# EAGLE design voltagereference (EAGLE 9.2.2)
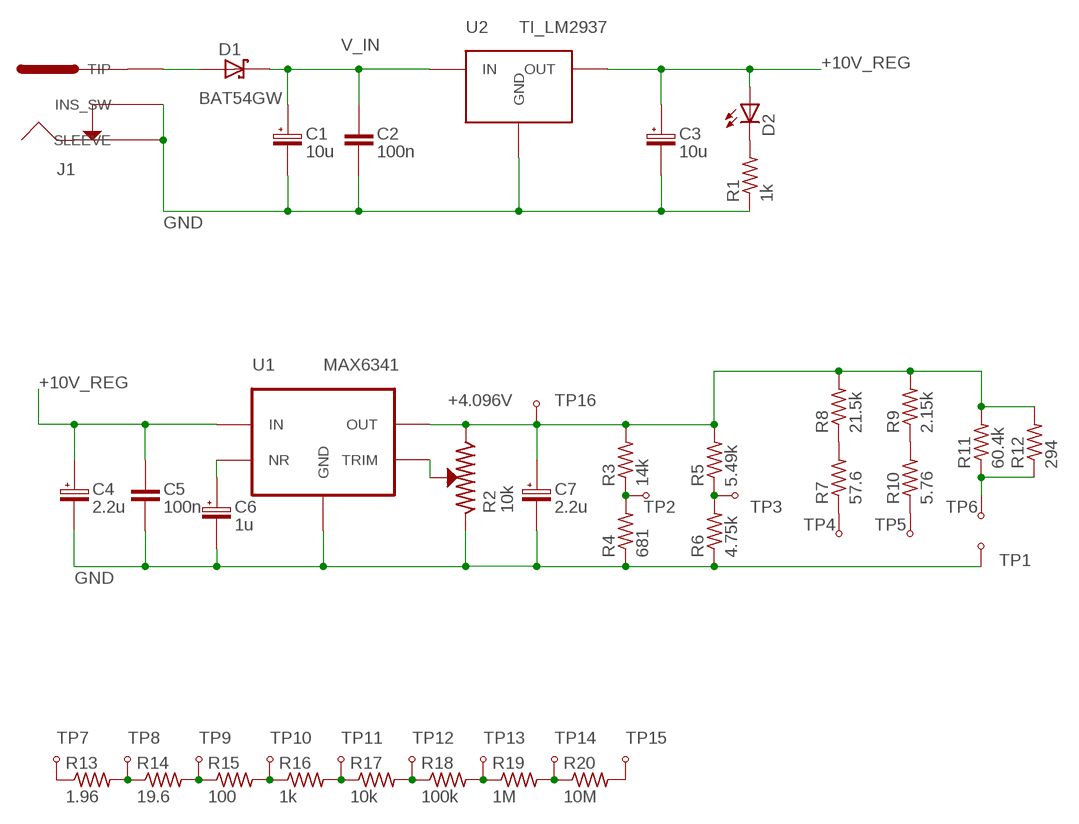
[diagram p0: schematic, sheet 1]

## Parts
C1  10u  PANASONIC_EEE_4MM  [PANASONIC_EEE_4MM]
C2  100n  C_0805  [0805]
C3  10u  PANASONIC_EEE_4MM  [PANASONIC_EEE_4MM]
C4  2.2u  PANASONIC_EEE_4MM  [PANASONIC_EEE_4MM]
C5  100n  C_0805  [0805]
C6  1u  PANASONIC_EEE_4MM  [PANASONIC_EEE_4MM]
C7  2.2u  PANASONIC_EEE_4MM  [PANASONIC_EEE_4MM]
D1  BAT54GW  NEX_BAT54GW  [SOD123_NEX]
D2  LED_0805  [0805_POL]
J1  KOBICONN_163-179PH-EX  [KOBICONN_163-179PH-EX]
R1  1k  R_0805  [0805]
R2  10k  BOURNS_3224X  [BOURNS_3224X]
R3  14k  R_0805  [0805]
R4  681  R_0805  [0805]
R5  5.49k  R_0805  [0805]
R6  4.75k  R_0805  [0805]
R7  57.6  R_0805  [0805]
R8  21.5k  R_0805  [0805]
R9  2.15k  R_0805  [0805]
R10  5.76  R_0805  [0805]
R11  60.4k  R_0805  [0805]
R12  294  R_0805  [0805]
R13  1.96  R_0603  [0603]
R14  19.6  R_0603  [0603]
R15  100  R_0805  [0805]
R16  1k  R_0805  [0805]
R17  10k  R_0805  [0805]
R18  100k  R_0805  [0805]
R19  1M  R_0805  [0805]
R20  10M  R_0805  [0805]
TP1  KEYSTONE_500X  [KEYSTONE_500X]
TP2  KEYSTONE_500X  [KEYSTONE_500X]
TP3  KEYSTONE_500X  [KEYSTONE_500X]
TP4  KEYSTONE_500X  [KEYSTONE_500X]
TP5  KEYSTONE_500X  [KEYSTONE_500X]
TP6  KEYSTONE_500X  [KEYSTONE_500X]
TP7  KEYSTONE_500X  [KEYSTONE_500X]
TP8  KEYSTONE_500X  [KEYSTONE_500X]
TP9  KEYSTONE_500X  [KEYSTONE_500X]
TP10  KEYSTONE_500X  [KEYSTONE_500X]
TP11  KEYSTONE_500X  [KEYSTONE_500X]
TP12  KEYSTONE_500X  [KEYSTONE_500X]
TP13  KEYSTONE_500X  [KEYSTONE_500X]
TP14  KEYSTONE_500X  [KEYSTONE_500X]
TP15  KEYSTONE_500X  [KEYSTONE_500X]
TP16  KEYSTONE_500X  [KEYSTONE_500X]
U1  MAX6341  MAXIM_MAX6341  [SO8_MAX]
U2  TI_LM2937  [SOT223_TI]

## Nets
0.19MA: R7.P$1 TP4.P$1(TP)
1.9MA: R10.P$1 TP5.P$1(TP)
14MA: R11.P$1 R12.P$1 TP6.P$1(TP)
+0.19V: R3.P$1 R4.P$2 TP2.P$1(TP)
+1.9V: R5.P$1 R6.P$2 TP3.P$1(TP)
+4.096V: C7.P$1 R2.P$1 R3.P$2 R5.P$2 R8.P$2 R9.P$2 R11.P$2 R12.P$2 TP16.P$1(TP) U1.P$6(OUT)
+10V_REG: C3.P$1 C4.P$1 C5.P$1 D2.P$1(A) U1.P$2(IN) U2.P$3(OUT)
GND: C1.P$2 C2.P$2 C3.P$2 C4.P$2 C5.P$2 C6.P$2 C7.P$2 J1.P$2(SLEEVE) J1.P$3(INS_SW) J1.P$5(SLEEVE) J1.P$6(INS_SW) R1.P$1 R2.P$3 R4.P$1 R6.P$1 TP1.P$1(TP) U1.P$4(GND) U2.P$2(GND) U2.P$4(GND)
N$1: D2.P$2(C) R1.P$2
N$6: R7.P$2 R8.P$1
N$7: R9.P$1 R10.P$2
N$11: R13.P$2 R14.P$1 TP8.P$1(TP)
N$12: R14.P$2 R15.P$1 TP9.P$1(TP)
N$13: R15.P$2 R16.P$1 TP10.P$1(TP)
N$14: R16.P$2 R17.P$1 TP11.P$1(TP)
N$15: R17.P$2 R18.P$1 TP12.P$1(TP)
N$16: R18.P$2 R19.P$1 TP13.P$1(TP)
N$17: R19.P$2 R20.P$1 TP14.P$1(TP)
N$18: R13.P$1 TP7.P$1(TP)
N$19: R20.P$2 TP15.P$1(TP)
NR: C6.P$1 U1.P$3(NR)
TIP: D1.P$1(A) J1.P$1(TIP) J1.P$4(TIP)
TRIM: R2.P$2 U1.P$5(TRIM)
V_IN: C1.P$1 C2.P$1 D1.P$2(C) U2.P$1(IN)

## Library data of the parts
C1 C3 C4 C6 C7 = travis:PANASONIC_EEE_4MM
C2 C5 = travis:C_0805
D1 = travis:NEX_BAT54GW
D2 = travis:LED_0805
J1 = travis:KOBICONN_163-179PH-EX
R1 R3-R12 R15-R20 = travis:R_0805
R2 = travis:BOURNS_3224X
R13 R14 = travis:R_0603
TP1-TP16 = travis:KEYSTONE_500X
U1 = travis:MAXIM_MAX6341
U2 = travis:TI_LM2937

## Board
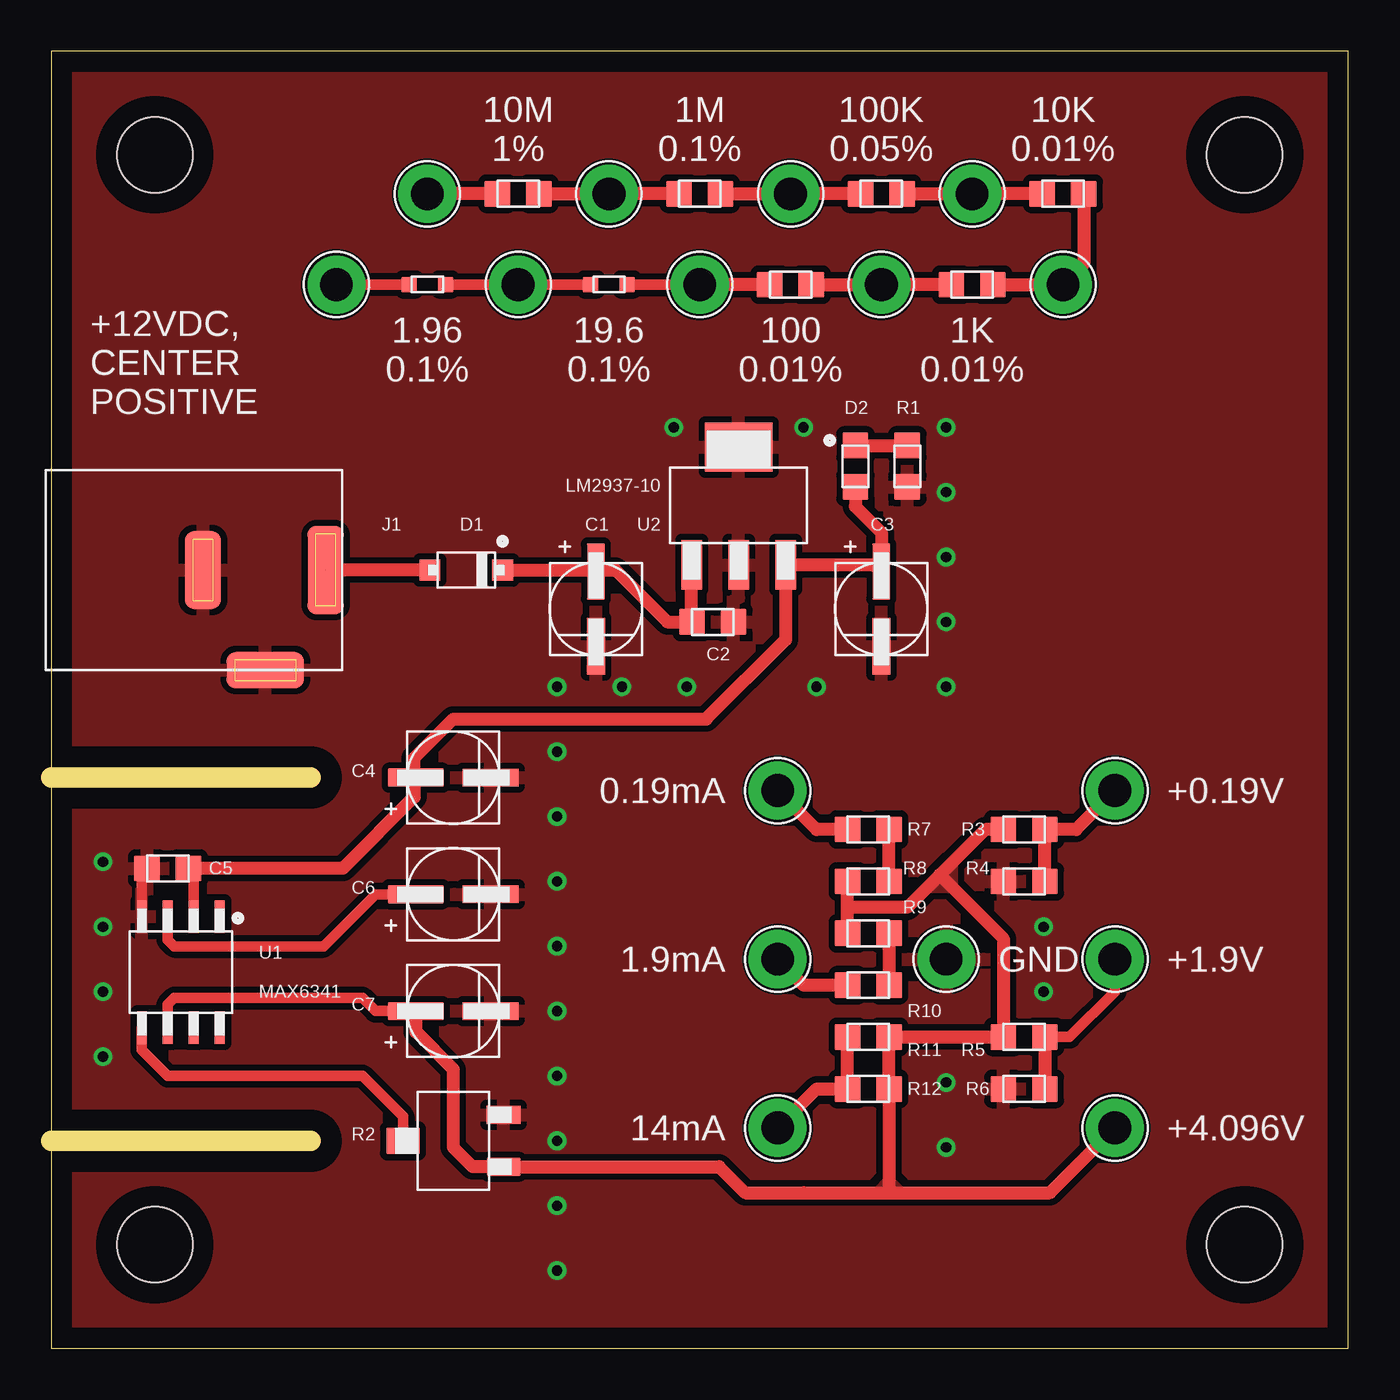
[diagram p1: board, top side]
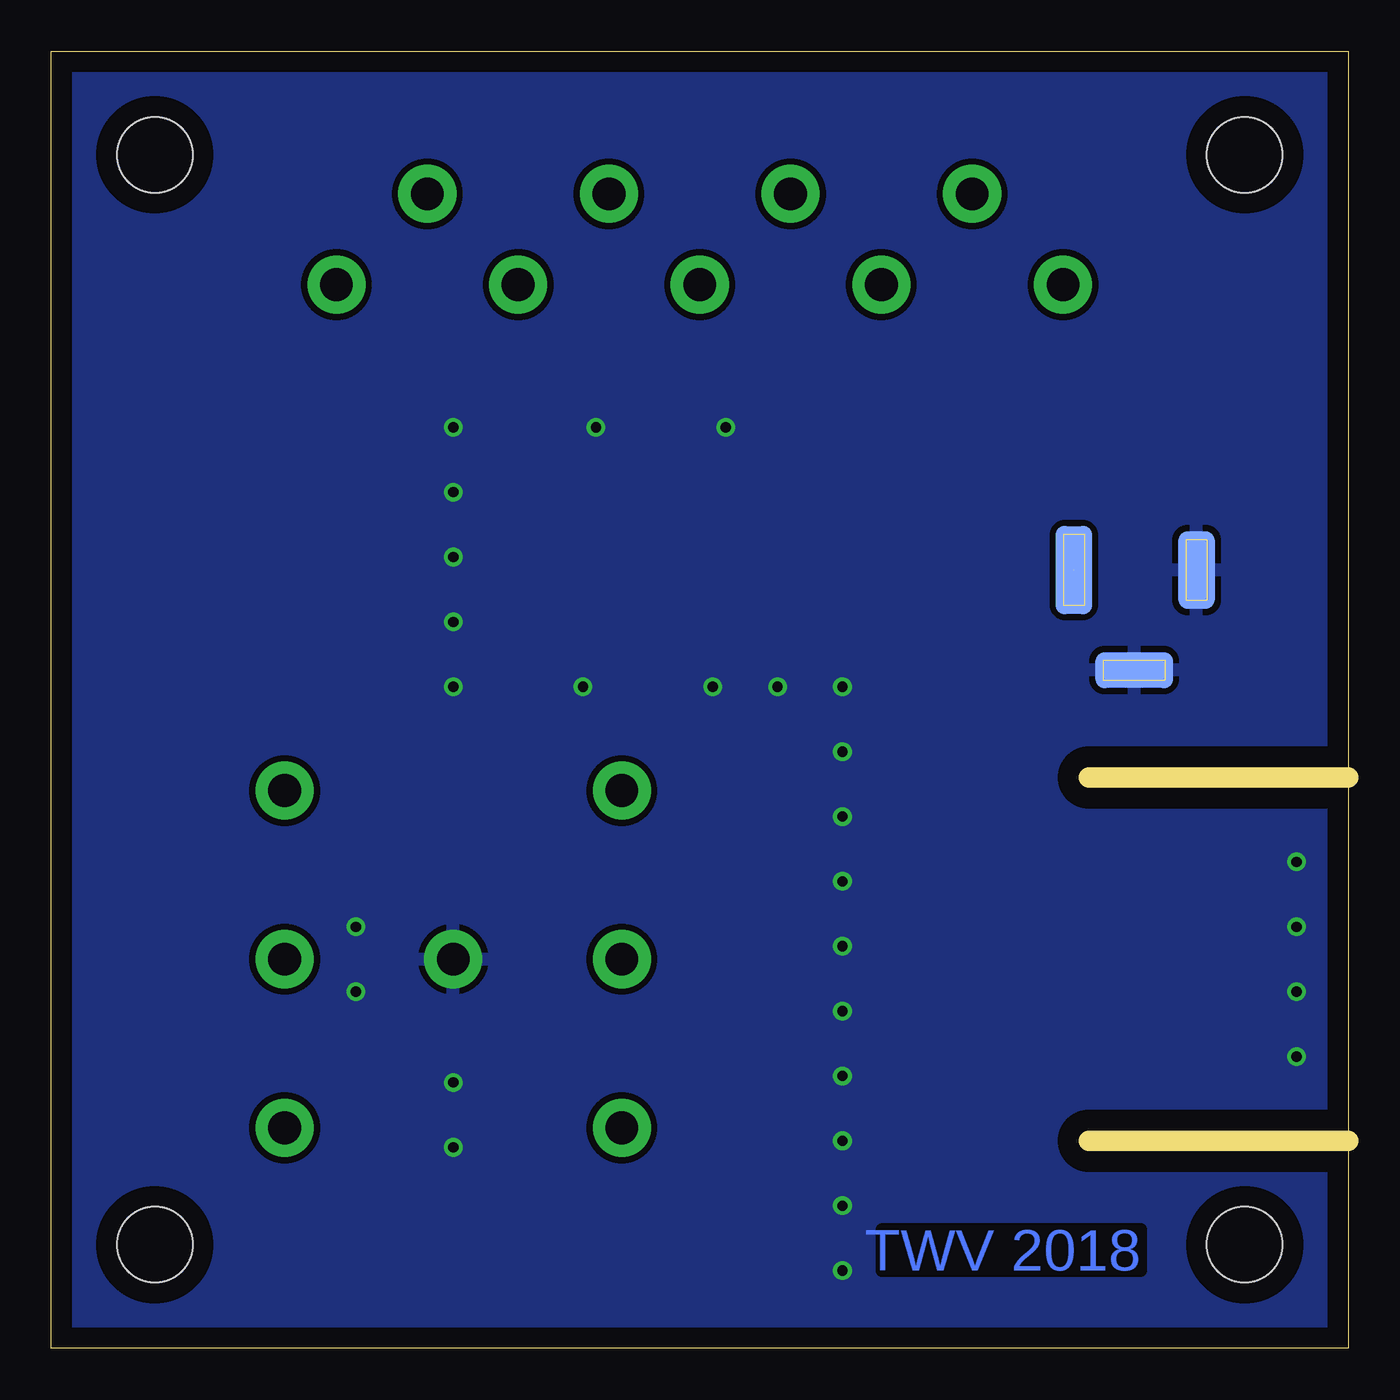
[diagram p2: board, bottom side, seen from below]

Size 63.5 x 63.5 mm. Coordinates in mm from the lower left corner, seen from the top.
Outline: 0,0 63.5,0 63.5,63.5 0,63.5 0,29.21 0,27.94 0,26.67 0,10.16 0,0
Copper layers (1*16): Top 0.035mm / dielectric 1.5mm / Bottom 0.035mm
Design rules "default *": minimum track width 15mil, minimum drill 0.5mm, track to track 12mil, track to pad 12mil, pad to pad 12mil, via to via 12mil, smd to smd 0mil, copper to edge 40mil, drill to drill 12mil, minimum pad ring 12mil, minimum via ring 8mil, stop-mask expansion 4mil, vias tented up to drill 20mil, thermal gap 12mil
Holes 3.7 mm at 5.08,58.42 58.42,58.42 5.08,5.08 58.42,5.08
tRestrict: 2 lines
bRestrict: 2 lines
Milling: 2 lines

### Footprints (pad centres in the part's own frame; a part is rotated, then mirrored left to right if it is on the bottom)
PANASONIC_EEE_4MM = smd 0.864 x 2.743: P$1 0,1.829; P$2 0,-1.829
0805 = smd 1.27 x 1.27: P$1 -1.016,0; P$2 1.016,0
SOD123_NEX = smd 1.016 x 1.016: P$1 -1.778,0; P$2 1.778,0
0805_POL = smd 1.27 x 1.27: P$1 -1.016,0; P$2 1.016,0
KOBICONN_163-179PH-EX = smd 1.778 x 4.318: P$1 6.45,0 | smd 3.81 x 1.778: P$2 3.5,-4.9 | smd 1.778 x 3.81: P$3 0.45,0 | smd 1.778 x 4.318 bottom: P$4 6.45,0 | smd 3.81 x 1.778 bottom: P$5 3.5,-4.9 | smd 1.778 x 3.81 bottom: P$6 0.45,0
BOURNS_3224X = smd 1.651 x 0.864: P$1 -2.464,1.27; P$3 -2.464,-1.27 | smd 1.651 x 1.321: P$2 2.464,0
0603 = smd 0.762 x 0.762: P$1 -0.889,0; P$2 0.889,0
KEYSTONE_500X = drill 1.6 pad 2.845: P$1 0,0
SO8_MAX = smd 0.533 x 1.6: P$1 -1.905,-2.718; P$2 -0.635,-2.718; P$3 0.635,-2.718; P$4 1.905,-2.718; P$5 1.905,2.718; P$6 0.635,2.718; P$7 -0.635,2.718; P$8 -1.905,2.718
SOT223_TI = smd 1.016 x 2.413: P$1 -2.3,-2.921; P$2 0,-2.921; P$3 2.3,-2.921 | smd 3.302 x 2.413: P$4 0,2.845

### Placement (x,y rotation side)
C1  26.67,36.2 0 top
C2  32.38,35.56 0 top
C3  40.64,36.2 0 top
C4  19.68,27.94 90 top
C5  5.71,23.5 180 top
C6  19.68,22.23 90 top
C7  19.68,16.51 90 top
D1  20.32,38.1 0 top
D2  39.37,43.18 90 top
J1  6.99,38.1 0 top
R1  41.91,43.18 90 top
R2  19.68,10.16 180 top
R3  47.62,25.4 180 top
R4  47.62,22.86 0 top
R5  47.62,15.24 180 top
R6  47.62,12.7 0 top
R7  40.01,25.4 0 top
R8  40.01,22.86 180 top
R9  40.01,20.32 180 top
R10  40.01,17.78 0 top
R11  40.01,15.24 0 top
R12  40.01,12.7 0 top
R13  18.41,52.07 0 top
R14  27.3,52.07 0 top
R15  36.2,52.07 0 top
R16  45.09,52.07 0 top
R17  49.53,56.52 180 top
R18  40.64,56.52 180 top
R19  31.75,56.52 180 top
R20  22.86,56.52 180 top
TP1  43.81,19.05 0 top
TP2  52.07,27.3 0 top
TP3  52.07,19.05 0 top
TP4  35.56,27.3 0 top
TP5  35.56,19.05 0 top
TP6  35.56,10.79 0 top
TP7  13.97,52.07 0 top
TP8  22.86,52.07 0 top
TP9  31.75,52.07 0 top
TP10  40.64,52.07 0 top
TP11  49.53,52.07 0 top
TP12  45.09,56.52 0 top
TP13  36.2,56.52 0 top
TP14  27.3,56.52 0 top
TP15  18.41,56.52 0 top
TP16  52.07,10.79 0 top
U1  6.35,18.41 180 top
U2  33.66,41.27 0 top

### Tracks (layer width: path | path; a pad name or v marks a point on that pad's centre or on a via)
0.19MA
  Top 0.635: R7.P$1 37.47,25.4 TP4.P$1
1.9MA
  Top 0.635: R10.P$1 36.83,17.78 TP5.P$1
14MA
  Top 0.635: TP6.P$1 37.47,12.7 R12.P$1 R11.P$1
+0.19V
  Top 0.635: R4.P$2 R3.P$1 50.16,25.4 TP2.P$1
+1.9V
  Top 0.508: R5.P$1 49.85,15.24 52.07,17.46 TP3.P$1
  Top 0.635: R5.P$1 R6.P$2
+4.096V
  Top 0.508: U1.P$6 5.71,16.83 6.03,17.14 15.24,17.14 15.88,16.51 C7.P$1
  Top 0.635: R9.P$2 38.99,21.59 | 38.99,21.59 R8.P$2 | 38.99,21.59 41.91,21.59 43.5,23.18 | R3.P$2 45.72,25.4 43.5,23.18 | 43.5,23.18 46.61,20.07 R5.P$2 R11.P$2 R12.P$2 41.02,7.68 40.96,7.62 | C7.P$1 17.86,15.48 19.68,13.65 19.68,9.84 20.64,8.89 R2.P$1 32.7,8.89 33.97,7.62 36.83,7.62 40.96,7.62 | 40.96,7.62 48.9,7.62 TP16.P$1
  pour Top: 42.86,22.54 44.13,23.81 44.13,22.54
  pour Top: 40.39,7.62 41.02,8.26 41.66,7.62
+10V_REG
  Top 0.508: C5.P$1 6.99,23.24 U1.P$2
  Top 0.635: 40.31,38.35 C3.P$1 | C3.P$1 40.64,39.94 39.37,41.21 D2.P$1 | C5.P$1 14.29,23.5 17.78,26.99 17.78,27.86 C4.P$1 17.78,28.02 17.78,28.89 19.68,30.8 32.07,30.8 35.95,34.69 U2.P$3 40.31,38.35 | C3.P$1 40.31,38.35
GND  (via drill 0.5)
  Top 0.508: U1.P$4 4.45,23.24 C5.P$2
  other vias: 24.77,22.86 24.77,26.04 24.77,29.21 24.77,16.51 24.77,13.34 24.77,32.38 37.47,32.38 27.94,32.38 31.11,32.38 30.48,45.09 36.83,45.09 24.77,3.81 24.77,6.99 2.54,20.64 43.81,32.38 43.81,38.73 24.77,19.68 24.77,10.16 43.81,35.56 43.81,41.91 43.81,13.02 43.81,9.84 48.58,17.46 48.58,20.64 2.54,17.46 2.54,14.29 2.54,23.81 43.81,45.09
  pour Top (rank 2): 0,63.5 63.5,63.5 63.5,0 0,0
  pour Bottom: 0,63.5 63.5,63.5 63.5,0 0,0
N$1
  Top 0.635: D2.P$2 R1.P$2
N$6
  Top 0.635: R8.P$1 R7.P$2
N$7
  Top 0.635: R9.P$1 R10.P$2
N$11
  Top 0.508: R13.P$2 TP8.P$1 R14.P$1
N$12
  Top 0.508: R14.P$2 TP9.P$1
  Top 0.635: R15.P$1 TP9.P$1
N$13
  Top 0.635: R15.P$2 TP10.P$1 R16.P$1
N$14
  Top 0.635: R16.P$2 TP11.P$1 50.55,53.09 R17.P$1
N$15
  Top 0.635: R17.P$2 TP12.P$1 R18.P$1
N$16
  Top 0.635: R18.P$2 TP13.P$1 R19.P$1
N$17
  Top 0.635: R19.P$2 TP14.P$1 R20.P$1
N$18
  Top 0.508: R13.P$1 TP7.P$1
N$19
  Top 0.635: R20.P$2 TP15.P$1
NR
  Top 0.508: C6.P$1 15.88,22.23 13.34,19.68 6.03,19.68 5.71,20 U1.P$3
TIP  (1 unrouted)
  Top 0.635: D1.P$1 J1.P$4
TRIM
  Top 0.508: U1.P$5 4.45,14.61 5.71,13.34 15.24,13.34 17.22,11.35 R2.P$2
V_IN
  Top 0.635: D1.P$2 26.59,38.1 C1.P$1 26.75,38.1 27.62,38.1 30.16,35.56 C2.P$1 31.36,35.57 U2.P$1

### Text on the board
Bottom: TWV 2018
tNames: 10M / 1% | 1M / 0.1% | 100K / 0.05% | 10K / 0.01% | 1.96 / 0.1% | 19.6 / 0.1% | 100 / 0.01% | 1K / 0.01% | +12VDC, / CENTER / POSITIVE | LM2937-10 | 0.19mA | +0.19V | 1.9mA | GND | +1.9V | 14mA | +4.096V
tDocu: MAX6341 Voltage Reference v1.1
_tNames: D2 | R1 | C1 | U2 | C3 | J1 | D1 | C2 | C4 | R3 | R7 | C5 | R8 | C6 | R4 | R9 | U1 | C7 | R10 | R5 | R11 | R12 | R6 | R2